# Altium schematic sheet CurrentSensors.SchDoc
size A4
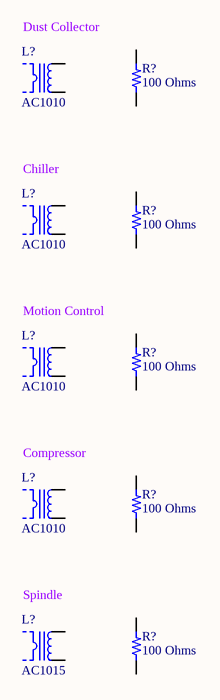
[diagram p0: CurrentSensors.SchDoc]

## Parts
(Parts that share a designator on the sheet are numbered #1, #2 ... from top to bottom, then left to right.)
L?#1  AC1010  [TALEMA AC1010]
L?#2  AC1010  [TALEMA AC1010]
L?#3  AC1010  [TALEMA AC1010]
L?#4  AC1010  [TALEMA AC1010]
L?#5  AC1015  [TALEMA AC1015]
R?#1  100 Ohms  [RES 0603_1608]
R?#2  100 Ohms  [RES 0603_1608]
R?#3  100 Ohms  [RES 0603_1608]
R?#4  100 Ohms  [RES 0603_1608]
R?#5  100 Ohms  [RES 0603_1608]

## Nets

Not connected (* = marked no-connect by the designer): L?#1 1 2; L?#2 1 2; L?#3 1 2; L?#4 1 2; L?#5 1 2; R?#1 1 2; R?#2 1 2; R?#3 1 2; R?#4 1 2; R?#5 1 2

## Notes on the sheet
- Dust Collector
- (near L?#2) Chiller
- Motion Control
- (near L?#4) Compressor
- (near L?#5) Spindle
- Title
- Size:
- Date:
- A4
- Number:
- Time:
- Revision:
- Sheet
- of
- File:

## Library data of the parts
L?#1-L?#4 = AC1010: CURR SENSE XFMR 10A T/H; Manufacturer: Talema Group LLC; Current Ratio: 1000:1; DC Resistance (DCR): 41.8Ohm; Frequency Range: 50/60Hz; Type: Non-Invasive (Solid Core); Part Number: AC1010; ComponentLink1Description: Datasheet; ComponentLink1URL: http://www.talema.com/uploads/documents/product-datasheets/AC%20Series.pdf; ComponentLink2Description: DigiKey Link; ComponentLink2URL: http://digikey.com/product-detail/en/talema-group-llc/AC1010/1295-1102-ND/3881333; Current Rating (Amps): 10A; Height - Seated (Max): 0.937" (23.80mm); LastUpdated: 07/01/2020 18:42:16; Lifecycle Status: Active; Minimum Order: 1; Mounting Type: Through Hole; Packaging: Tube; Part Status: Active; Price: 5.81; Series: AC; Size / Dimension: 0.937" L x 0.438" W (23.80mm x 11.12mm); Supplier 1: DigiKey; Supplier Part Number 1: 1295-1102-ND; Termination Style: PC Pin
L?#5 = AC1015: CURR SENSE XFMR 15A T/H; Manufacturer: Talema Group LLC; Current Ratio: 1000:1; DC Resistance (DCR): 41.8Ohm; Frequency Range: 50/60Hz; Type: Non-Invasive (Solid Core); Part Number: AC1015; ComponentLink1Description: Datasheet; ComponentLink1URL: http://www.talema.com/uploads/documents/product-datasheets/AC%20Series.pdf; ComponentLink2Description: DigiKey Link; ComponentLink2URL: http://digikey.com/product-detail/en/talema-group-llc/AC1015/1295-1097-ND/3881397; Current Rating (Amps): 15A; Height - Seated (Max): 0.937" (23.80mm); LastUpdated: 07/01/2020 18:42:34; Lifecycle Status: Active; Minimum Order: 1; Mounting Type: Through Hole; Packaging: Tube; Part Status: Active; Price: 5.81; Series: AC; Size / Dimension: 0.937" L x 0.438" W (23.80mm x 11.12mm); Supplier 1: DigiKey; Supplier Part Number 1: 1295-1097-ND; Termination Style: PC Pin
R?#1-R?#5 = ESR03EZPJ101: RES SMD 100 OHM 5% 1/4W 0603; Manufacturer: Rohm Semiconductor; Power (Watts): 0.25W, 1/4W; Temperature Coefficient: ±200ppm/°C; Part Number: ESR03EZPJ101; Value: 100 Ohms; ComponentLink1Description: Datasheet; ComponentLink1URL: https://www.rohm.com/datasheet/ESR01MZPF/esr-e; ComponentLink2Description: DigiKey Link; ComponentLink2URL: http://digikey.com/product-detail/en/rohm-semiconductor/ESR03EZPJ101/RHM100DCT-ND/1983776; Composition: Thick Film; Device Package: 0603 (1608 Metric); Features: Automotive AEC-Q200, Pulse Withstanding; Height - Seated (Max): 0.022" (0.55mm); LastUpdated: 02/01/2020 00:07:02; Lifecycle Status: Active; Minimum Order: 1; Number of Terminations: 2; Operating Temperature: -55°C ~ 155°C; Package / Case: 0603 (1608 Metric); Packaging: ReReel; PartId: 5450; Part Status: Active; Price: 0.00; Ratings: AEC-Q200; Resistance: 100 Ohms; Series: ESR; Size / Dimension: 0.063" L x 0.031" W (1.60mm x 0.80mm); Supplier 1: DigiKey; Supplier Part Number 1: RHM100DCT-ND; Supplier Device Package: 0603; Tolerance: ±5%